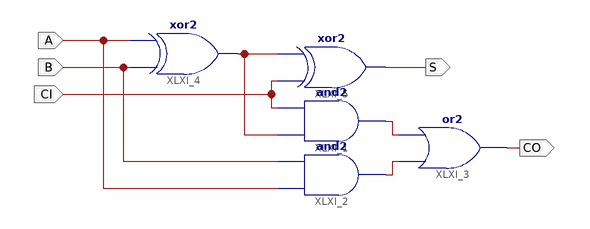
[diagram p0: schematic sheet 1]
// Xilinx ISE schematic fa.sch (virtex6) as structural Verilog: 5 symbols, 5 ports
module fa (
  input  CI,
  input  B,
  input  A,
  output S,
  output CO
);

  wire XLXN_3, XLXN_6, XLXN_7;

  xor XLXI_4 (XLXN_3, B, A);
  xor XLXI_5 (S, CI, XLXN_3);
  and XLXI_1 (XLXN_6, XLXN_3, CI);
  and XLXI_2 (XLXN_7, A, B);
  or XLXI_3 (CO, XLXN_7, XLXN_6);
endmodule
